# EAGLE schematic BenchPsu (EAGLE 6.6.0)
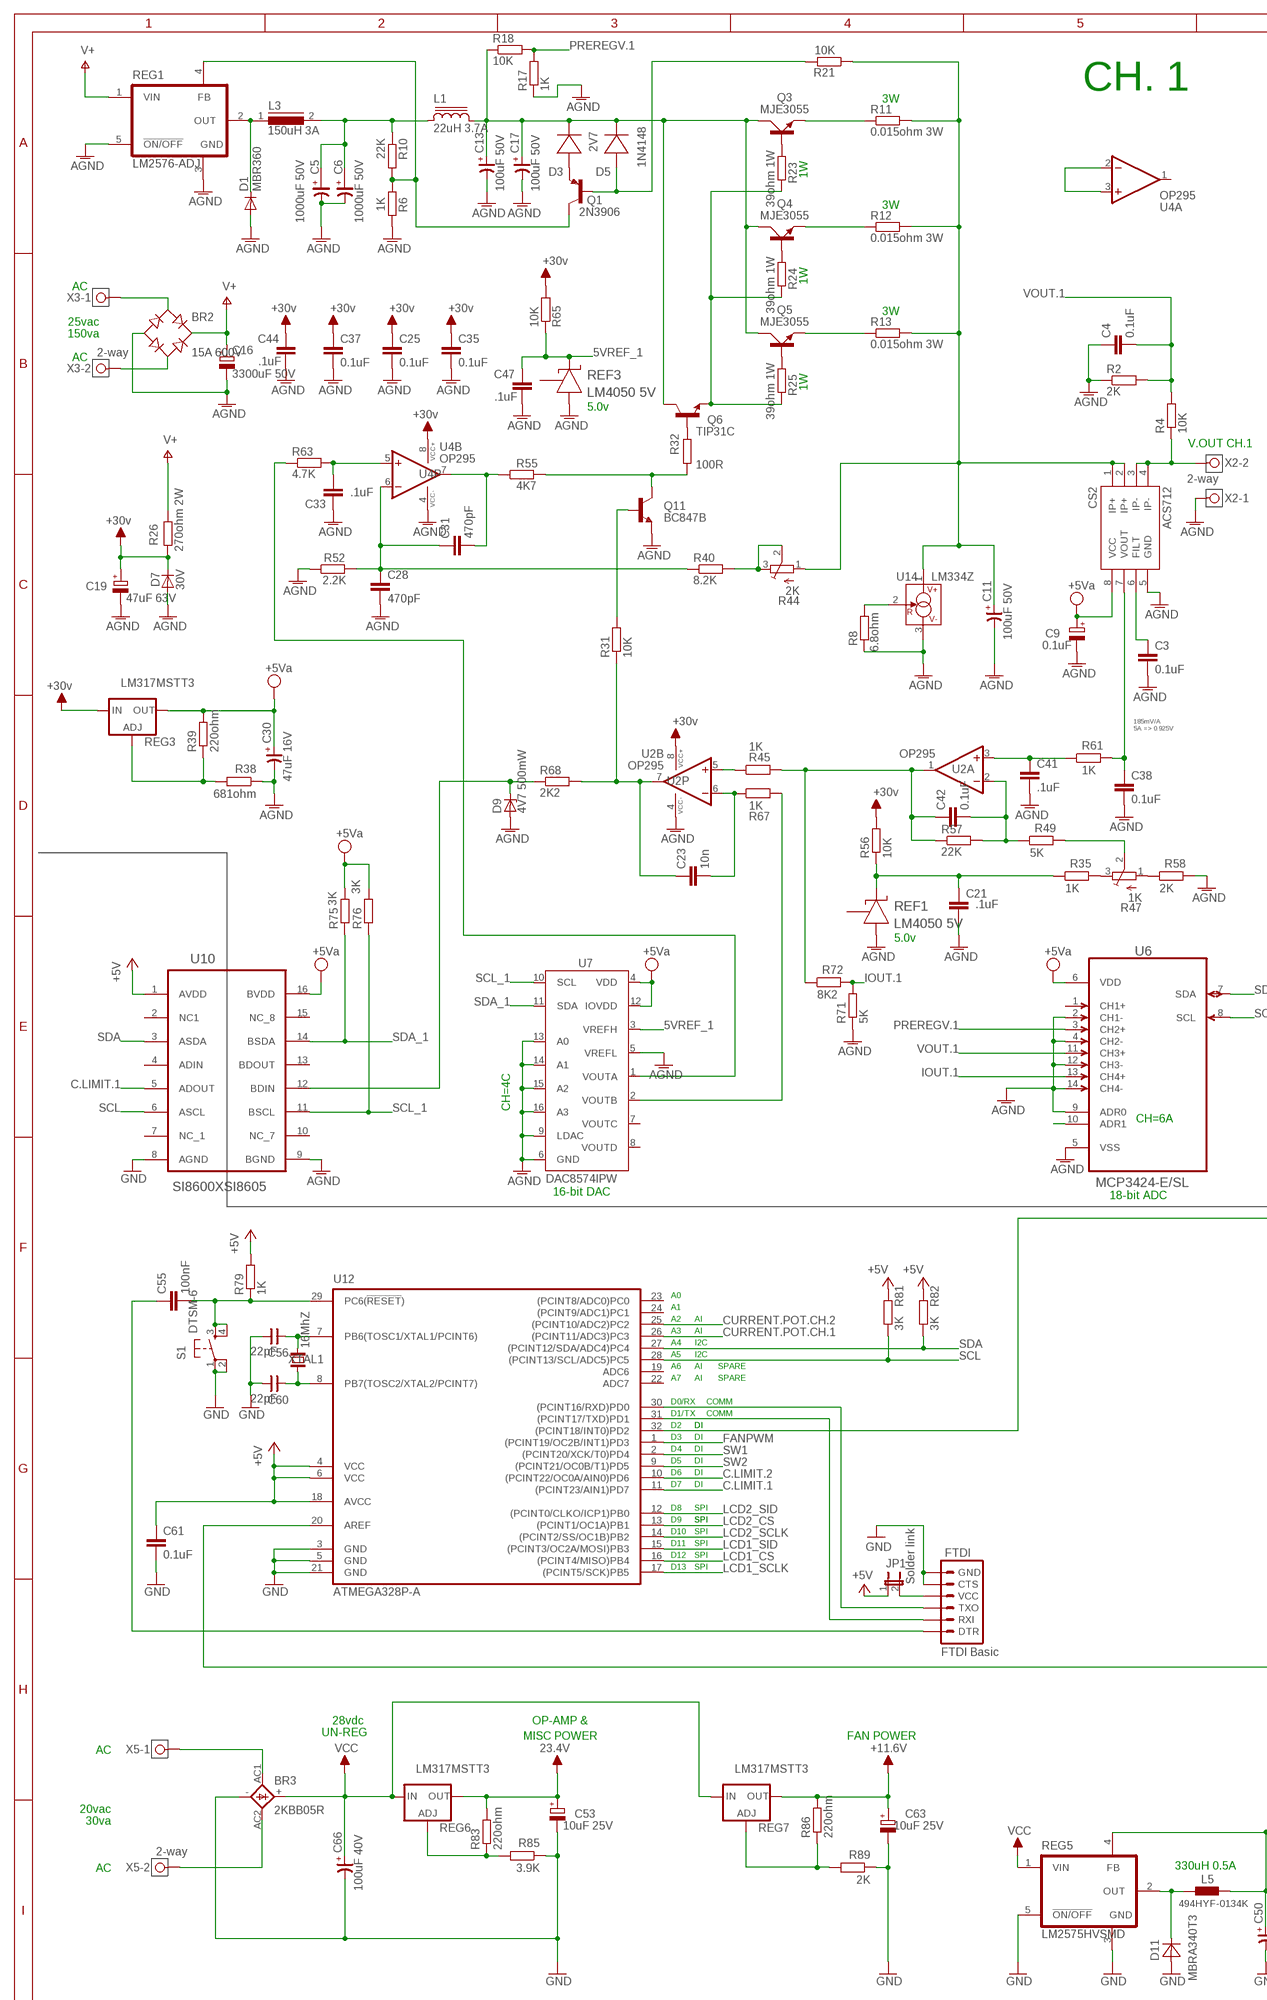
[diagram p0: schematic, sheet 1, part 1 of 2]
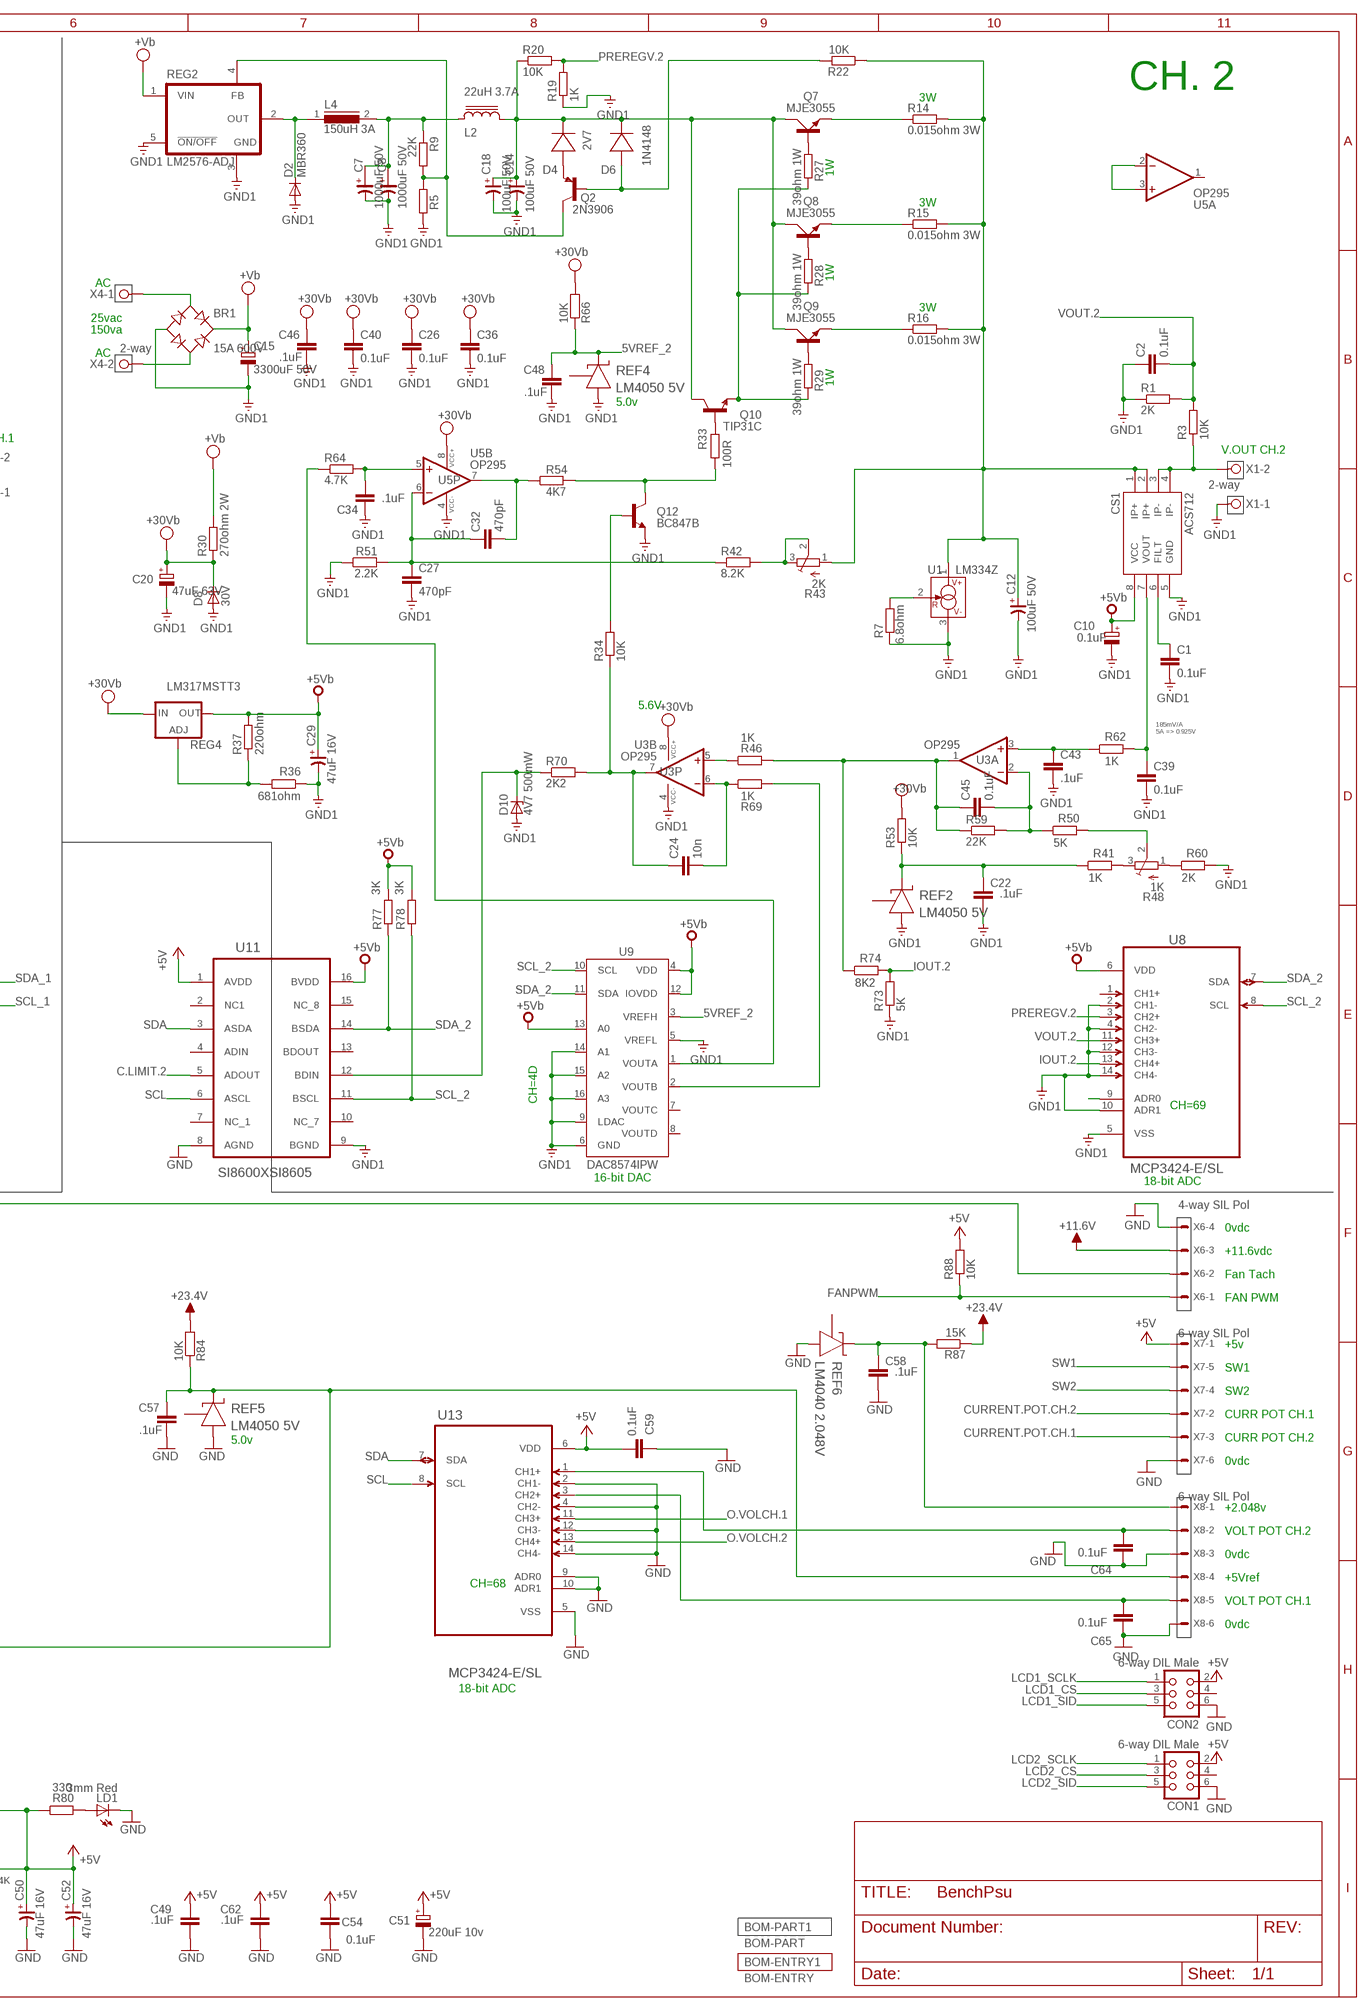
[diagram p1: schematic, sheet 1, part 2 of 2]
BOM-PART1 (BOM-PART): BOM: INCLUDE; QTY: 1

## Parts
BR1  15A 600V  GSIB_15A  [GSIB_15A]
BR2  15A 600V  GSIB_15A  [GSIB_15A]
BR3  2KBB05R  2KBB-R  [2KBB-R]
C1  0.1uF  C-EUC0805  [C0805]
C2  0.1uF  C-EUC0805  [C0805]
C3  0.1uF  C-EUC0805  [C0805]
C4  0.1uF  C-EUC0805  [C0805]
C5  1000uF 50V  C-PRE5,0-12  [E5,0-12]
C6  1000uF 50V  C-PRE5,0-12  [E5,0-12]
C7  1000uF 50V  C-PRE5,0-12  [E5,0-12]
C8  1000uF 50V  C-PRE5,0-12  [E5,0-12]
C9  0.1uF  CPOL-EUE2-5  [E2-5]
C10  0.1uF  CPOL-EUE2-5  [E2-5]
C11  100uF 50V  CP-E-050X125  [E-050X125]
C12  100uF 50V  CP-E-050X125  [E-050X125]
C13  100uF 50V  CP-E-035X080  [E-035X080]
C14  100uF 50V  CP-E-035X080  [E-035X080]
C15  3300uF 50V  CPOL-EUE7.5-18  [E7,5-18]
C16  3300uF 50V  CPOL-EUE7.5-18  [E7,5-18]
C17  100uF 50V  CP-E-035X080  [E-035X080]
C18  100uF 50V  CP-E-035X080  [E-035X080]
C19  47uF 63V  CPOL-EUE2.5-7  [E2,5-7]
C20  47uF 63V  CPOL-EUE2.5-7  [E2,5-7]
C21  .1uF  C-EUC0805  [C0805]
C22  .1uF  C-EUC0805  [C0805]
C23  10n  C-EUC0805  [C0805]
C24  10n  C-EUC0805  [C0805]
C25  0.1uF  C-EUC0805  [C0805]
C26  0.1uF  C-EUC0805  [C0805]
C27  470pF  C-EUC0805  [C0805]
C28  470pF  C-EUC0805  [C0805]
C29  47uF 16V  CP-SV-C  [SV-C]
C30  47uF 16V  CP-SV-C  [SV-C]
C31  470pF  C-EUC0805  [C0805]
C32  470pF  C-EUC0805  [C0805]
C33  .1uF  C-EUC0805  [C0805]
C34  .1uF  C-EUC0805  [C0805]
C35  0.1uF  C-EUC0805  [C0805]
C36  0.1uF  C-EUC0805  [C0805]
C37  0.1uF  C-EUC0805  [C0805]
C38  0.1uF  C-EUC0805  [C0805]
C39  0.1uF  C-EUC0805  [C0805]
C40  0.1uF  C-EUC0805  [C0805]
C41  .1uF  C-EUC0805  [C0805]
C42  0.1uF  C-EUC0805  [C0805]
C43  .1uF  C-EUC0805  [C0805]
C44  .1uF  C-EUC0805  [C0805]
C45  0.1uF  C-EUC0805  [C0805]
C46  .1uF  C-EUC0805  [C0805]
C47  .1uF  C-EUC0805  [C0805]
C48  .1uF  C-EUC0805  [C0805]
C49  .1uF  C-EUC0805  [C0805]
C50  47uF 16V  CP-SV-C  [SV-C]
C51  220uF 10v  CPOL-EUE2-5  [E2-5]
C52  47uF 16V  CP-SV-C  [SV-C]
C53  10uF 25V  CPOL-EUE2-5  [E2-5]
C54  0.1uF  C-EUC0805  [C0805]
C55  100nF  C-EUC0805  [C0805]
C56  22pF  CBP-ENP-015-040  [ENP-015-040]
C57  .1uF  C-EUC0805  [C0805]
C58  .1uF  C-EUC0805  [C0805]
C59  0.1uF  C-EUC0805  [C0805]
C60  22pF  CBP-ENP-015-040  [ENP-015-040]
C61  0.1uF  C-EUC0805  [C0805]
C62  .1uF  C-EUC0805  [C0805]
C63  10uF 25V  CPOL-EUE2-5  [E2-5]
C64  0.1uF  C-EUC0805  [C0805]
C65  0.1uF  C-EUC0805  [C0805]
C66  100uF 40V  CP-SV-E/F  [SV-E/F]
CON1  6-way DIL Male  CON06  [CON06]
CON2  6-way DIL Male  CON06  [CON06]
CS1  ACS712  [SO08]
CS2  ACS712  [SO08]
D1  MBR360  1N5400VERTICAL  [DO-201-15_V]
D2  MBR360  1N5400VERTICAL  [DO-201-15_V]
D3  2V7  DIODE  [SOD123]
D4  2V7  DIODE  [SOD123]
D5  1N4148  DIODE  [SOD123]
D6  1N4148  DIODE  [SOD123]
D7  30V  1N5060GPVERTICAL  [D015-12_V]
D8  30V  1N5060GPVERTICAL  [D015-12_V]
D9  4V7 500mW  ZENER-DIODESOD80C  [SOD80C]
D10  4V7 500mW  ZENER-DIODESOD80C  [SOD80C]
D11  MBRA340T3  [SMA]
FTDI  FTDI Basic  ARDUINO_SERIAL_PROGRAMPTH  [1X06]
JP1  Solder link  JP1E  [JP1]
L1  22uH 3.7A  L-  [RS749-8366_THT22UH]
L2  22uH 3.7A  L-  [RS749-8366_THT22UH]
L3  150uH 3A  SFT1030  [SFT1030]
L4  150uH 3A  SFT1030  [SFT1030]
L5  494HYF-0134K  [0.2PIN_0.3DIA]
LD1  3mm Red  LED3MM  [LED3MM]
Q1  2N3906  BC327SMD  [SOT23-BEC]
Q2  2N3906  BC327SMD  [SOT23-BEC]
Q3  MJE3055  [TO220AV]
Q4  MJE3055  [TO220AV]
Q5  MJE3055  [TO220AV]
Q6  TIP31C  TIP31CVERTICAL  [TO220V]
Q7  MJE3055  [TO220AV]
Q8  MJE3055  [TO220AV]
Q9  MJE3055  [TO220AV]
Q10  TIP31C  TIP31CVERTICAL  [TO220V]
Q11  BC847B  BC847BSMD  [SOT23]
Q12  BC847B  BC847BSMD  [SOT23]
R1  2K  R-EU_R0805  [R0805]
R2  2K  R-EU_R0805  [R0805]
R3  10K  R-EU_R0805  [R0805]
R4  10K  R-EU_R0805  [R0805]
R5  1K  R-EU_R0805  [R0805]
R6  1K  R-EU_R0805  [R0805]
R7  6.8ohm  R-EU_R0805  [R0805]
R8  6.8ohm  R-EU_R0805  [R0805]
R9  22K  R-EU_R0805  [R0805]
R10  22K  R-EU_R0805  [R0805]
R11  0.015ohm 3W  R-EU_R2512  [R2512]
R12  0.015ohm 3W  R-EU_R2512  [R2512]
R13  0.015ohm 3W  R-EU_R2512  [R2512]
R14  0.015ohm 3W  R-EU_R2512  [R2512]
R15  0.015ohm 3W  R-EU_R2512  [R2512]
R16  0.015ohm 3W  R-EU_R2512  [R2512]
R17  1K  R-EU_R0805  [R0805]
R18  10K  R-EU_R0805  [R0805]
R19  1K  R-EU_R0805  [R0805]
R20  10K  R-EU_R0805  [R0805]
R21  10K  R-EU_R0805  [R0805]
R22  10K  R-EU_R0805  [R0805]
R23  39ohm 1W  R-EU_0411/3V  [0411V]
R24  39ohm 1W  R-EU_0411/3V  [0411V]
R25  39ohm 1W  R-EU_0411/3V  [0411V]
R26  270ohm 2W  R-EU_0613/5V  [P0613V]
R27  39ohm 1W  R-EU_0411/3V  [0411V]
R28  39ohm 1W  R-EU_0411/3V  [0411V]
R29  39ohm 1W  R-EU_0411/3V  [0411V]
R30  270ohm 2W  R-EU_0613/5V  [P0613V]
R31  10K  R-EU_R0805  [R0805]
R32  100R  R-EU_R0805  [R0805]
R33  100R  R-EU_R0805  [R0805]
R34  10K  R-EU_R0805  [R0805]
R35  1K  R-EU_R0805  [R0805]
R36  681ohm  R-EU_R0805  [R0805]
R37  220ohm  R-EU_R0805  [R0805]
R38  681ohm  R-EU_R0805  [R0805]
R39  220ohm  R-EU_R0805  [R0805]
R40  8.2K  R-EU_R0805  [R0805]
R41  1K  R-EU_R0805  [R0805]
R42  8.2K  R-EU_R0805  [R0805]
R43  2K  TRIM_EU-SM-42/43W  [SM-42/43W]
R44  2K  TRIM_EU-SM-42/43W  [SM-42/43W]
R45  1K  R-EU_R0805  [R0805]
R46  1K  R-EU_R0805  [R0805]
R47  1K  TRIM_EU-3223W  [3223W]
R48  1K  TRIM_EU-SM-42/43W  [SM-42/43W]
R49  5K  R-EU_R0805  [R0805]
R50  5K  R-EU_R0805  [R0805]
R51  2.2K  R-EU_R0805  [R0805]
R52  2.2K  R-EU_R0805  [R0805]
R53  10K  R-EU_R0805  [R0805]
R54  4K7  R-EU_R0805  [R0805]
R55  4K7  R-EU_R0805  [R0805]
R56  10K  R-EU_R0805  [R0805]
R57  22K  R-EU_R0805  [R0805]
R58  2K  R-EU_R0805  [R0805]
R59  22K  R-EU_R0805  [R0805]
R60  2K  R-EU_R0805  [R0805]
R61  1K  R-EU_R0805  [R0805]
R62  1K  R-EU_R0805  [R0805]
R63  4.7K  R-EU_R0805  [R0805]
R64  4.7K  R-EU_R0805  [R0805]
R65  10K  R-EU_R0805  [R0805]
R66  10K  R-EU_R0805  [R0805]
R67  1K  R-EU_R0805  [R0805]
R68  2K2  R-EU_R0805  [R0805]
R69  1K  R-EU_R0805  [R0805]
R70  2K2  R-EU_R0805  [R0805]
R71  5K  R-EU_R0805  [R0805]
R72  8K2  R-EU_R0805  [R0805]
R73  5K  R-EU_R0805  [R0805]
R74  8K2  R-EU_R0805  [R0805]
R75  3K  R-EU_R0805  [R0805]
R76  3K  R-EU_R0805  [R0805]
R77  3K  R-EU_R0805  [R0805]
R78  3K  R-EU_R0805  [R0805]
R79  1K  R-EU_R0805  [R0805]
R80  330  R-EU_R0805  [R0805]
R81  3K  R-EU_R0805  [R0805]
R82  3K  R-EU_R0805  [R0805]
R83  220ohm  R-EU_R0805  [R0805]
R84  10K  R-EU_R0805  [R0805]
R85  3.9K  R-EU_R0805  [R0805]
R86  220ohm  R-EU_R0805  [R0805]
R87  15K  R-EU_R0805  [R0805]
R88  10K  R-EU_R0805  [R0805]
R89  2K  R-EU_R0805  [R0805]
REF1  LM4050 5V  LM4040A20IDBZT  [SOT95P237X112-3N]
REF2  LM4050 5V  LM4040A20IDBZT  [SOT95P237X112-3N]
REF3  LM4050 5V  LM4040A20IDBZT  [SOT95P237X112-3N]
REF4  LM4050 5V  LM4040A20IDBZT  [SOT95P237X112-3N]
REF5  LM4050 5V  LM4040A20IDBZT  [SOT95P237X112-3N]
REF6  LM4040 2.048V  LM4040A20IDBZT  [SOT95P237X112-3N]
REG1  LM2576-ADJ  LM2575HV_VVERTICAL_2  [LM2575HV_V_2]
REG2  LM2576-ADJ  LM2575HV_VVERTICAL_2  [LM2575HV_V_2]
REG3  LM317MSTT3  [SOT223]
REG4  LM317MSTT3  [SOT223]
REG5  LM2575HVSMD  [TO263-5]
REG6  LM317MSTT3  [SOT223]
REG7  LM317MSTT3  [SOT223]
S1  DTSM-6  [DTSM-6]
U1  LM334Z  [TO92]
U2  OP295  TL072N  [SO08]
U3  OP295  TL072N  [SO08]
U4  OP295  TL072N  [SO08]
U5  OP295  TL072N  [SO08]
U6  MCP3424-E/SL  [SOIC127P600X175-14N]
U7  DAC8574IPW  [TSSOP16]
U8  MCP3424-E/SL  [SOIC127P600X175-14N]
U9  DAC8574IPW  [TSSOP16]
U10  SI8600XSI8605  [SOIC16N]
U11  SI8600XSI8605  [SOIC16N]
U12  ATMEGA328P-A  ATMEGA48P/88P/168P/328P-A  [TQFP32A]
U13  MCP3424-E/SL  [SOIC127P600X175-14N]
U14  LM334Z  [TO92]
X1  2-way  W237-02P  [W237-132]
X2  2-way  W237-02P  [W237-132]
X3  2-way  W237-02P  [W237-132]
X4  2-way  W237-02P  [W237-132]
X5  2-way  W237-02P  [W237-132]
X6  4-way SIL Pol  22-23-2041  [22-23-2041]
X7  6-way SIL Pol  22-23-2061  [22-23-2061]
X8  6-way SIL Pol  22-23-2061  [22-23-2061]
XTAL1  16MhZ  CRYTALHC49S  [HC49/S@1]

## Nets
2.048V: C58.1 R87.2 REF6.1(CATHODE) X8.1
5VREF_1: C47.1 R65.1 REF3.1(CATHODE) U7.3(VREFH)
5VREF_2: C48.1 R66.1 REF4.1(CATHODE) U9.3(VREFH)
+5V: C49.1 C50.+ C51.+ C52.+ C54.2 C59.1 C61.1 C62.1 CON1.2 CON2.2 JP1.1 L5.2 R79.2 R80.1 R81.2 R82.2 R88.2 REG5.4(FB) U10.1(AVDD) U11.1(AVDD) U12.4(VCC) U12.6(VCC) U12.18(AVCC) U13.6(VDD) X7.1
+5VT: C10.+ C29.+ CS1.8(VCC) R37.2 R77.2 R78.2 REG4.4(OUT) U8.6(VDD) U9.4(VDD) U9.12(IOVDD) U9.13(A0) U11.16(BVDD) ; supply symbol labelled +5Vb
+12V: C63.+ R86.2 REG7.4(OUT) X6.3 ; supply symbol labelled +11.6V
+24V: C53.+ R83.2 R84.2 R87.1 REG6.4(OUT) ; supply symbol labelled 23.4V, +23.4V
AGND: BR2.- C3.2 C4.1 C5.- C6.- C9.- C11.- C13.- C16.- C17.- C19.- C21.2 C25.2 C28.2 C30.- C33.1 C35.2 C37.2 C38.2 C41.2 C44.2 C47.2 CS2.5(GND) D1.A D7.A D9.A Q11.2(E) R2.1 R6.2 R8.1 R17.1 R38.1 R52.1 R58.2 R71.1 REF1.2(A) REF3.2(A) REG1.3(GND) REG1.5(!ON/OFF) U2.4(P:VCC-) U4.4(P:VCC-) U6.2(CH1-) U6.4(CH2-) U6.5(VSS) U6.9(ADR0) U6.12(CH3-) U6.14(CH4-) U7.5(VREFL) U7.6(GND) U7.9(LDAC) U7.13(A0) U7.14(A1) U7.15(A2) U7.16(A3) U10.9(BGND) U14.3(V-) X2.1
AVCC: C19.+ C25.1 C35.1 C37.1 C44.1 D7.C R26.1 R56.2 R65.2 REG3.3(IN) U2.8(P:VCC+) U4.8(P:VCC+) ; supply symbol labelled +30v
C.LIMIT.1: U10.5(ADOUT) U12.11((PCINT23/AIN1)PD7)
C.LIMIT.2: U11.5(ADOUT) U12.10((PCINT22/OC0A/AIN0)PD6)
CURRENT.POT.CH.1: U12.26((PCINT11/ADC3)PC3) X7.3
CURRENT.POT.CH.2: U12.25((PCINT10/ADC2)PC2) X7.2
FANPWM: R88.1 U12.1((PCINT19/OC2B/INT1)PD3) X6.1
GND: BR3.- C49.2 C50.- C51.- C52.- C53.- C54.1 C56.1 C57.2 C58.2 C59.2 C60.1 C61.2 C62.2 C63.- C64.2 C65.2 C66.- CON1.6 CON2.6 D11.A FTDI.5(CTS) FTDI.6(GND) LD1.K(C) R85.1 R89.1 REF5.2(A) REF6.2(A) REG5.3(GND) REG5.5(!ON/OFF) S1.1 S1.2 U10.8(AGND) U11.8(AGND) U12.3(GND) U12.5(GND) U12.21(GND) U13.2(CH1-) U13.4(CH2-) U13.5(VSS) U13.9(ADR0) U13.10(ADR1) U13.12(CH3-) U13.14(CH4-) X6.4 X7.6 X8.3 X8.6
GND1: BR1.- C1.2 C2.1 C7.- C8.- C10.- C12.- C14.- C15.- C18.- C20.- C22.2 C26.2 C27.2 C29.- C34.1 C36.2 C39.2 C40.2 C43.2 C46.2 C48.2 CS1.5(GND) D2.A D8.A D10.A Q12.2(E) R1.1 R5.2 R7.1 R19.1 R36.1 R51.1 R60.2 R73.1 REF2.2(A) REF4.2(A) REG2.3(GND) REG2.5(!ON/OFF) U1.3(V-) U3.4(P:VCC-) U5.4(P:VCC-) U8.2(CH1-) U8.4(CH2-) U8.5(VSS) U8.10(ADR1) U8.12(CH3-) U8.14(CH4-) U9.5(VREFL) U9.6(GND) U9.9(LDAC) U9.14(A1) U9.15(A2) U9.16(A3) U11.9(BGND) X1.1
IOUT.1: R71.2 R72.2 U6.13(CH4+)
IOUT.2: R73.2 R74.2 U8.13(CH4+)
LCD1_CS: CON2.3 U12.16((PCINT4/MISO)PB4)
LCD1_SCLK: CON2.1 U12.17((PCINT5/SCK)PB5)
LCD1_SID: CON2.5 U12.15((PCINT3/OC2A/MOSI)PB3)
LCD2_CS: CON1.3 U12.13((PCINT1/OC1A)PB1)
LCD2_SCLK: CON1.1 U12.14((PCINT2/SS/OC1B)PB2)
LCD2_SID: CON1.5 U12.12((PCINT0/CLKO/ICP1)PB0)
N$1: R38.2 R39.1 REG3.1(ADJ)
N$2: BR3.AC1 X5.1
N$3: D11.C L5.1 REG5.2(OUT)
N$4: BR3.AC2 X5.2
N$5: R47.2(S) R49.2
N$6: C42.2 R49.1 R57.2 U2.2(A:-IN)
N$7: C5.+ C6.+ L1.1 L3.2 R10.1
N$8: C41.1 R61.1 U2.3(A:+IN)
N$10: Q1.C R6.1 R10.2 REG1.4(FB)
N$11: D3.A(+) Q1.E
N$12: D5.A(+) Q1.B R21.2
N$13: R83.1 R85.2 REG6.1(ADJ)
N$15: C31.2 R55.1 U4.7(B:OUT)
N$17: C28.1 C31.1 R40.1 R52.2 U4.6(B:-IN)
N$19: Q11.1(B) R31.2
N$20: C23.1 R31.1 R68.2 U2.7(B:OUT)
N$22: R40.2 R44.2(S) R44.3(E)
N$23: R64.1 U9.1(VOUTA)
N$24: BR2.AC1 X3.1
N$25: U12.32((PCINT18/INT0)PD2) X6.2
N$26: LD1.A R80.2
N$27: C57.1 R84.1 REF5.1(CATHODE) U12.20(AREF) X8.4
N$28: C38.1 CS2.7(VOUT) R61.2
N$29: Q3.B R23.1
N$31: C55.1 FTDI.1(DTR)
N$32: C33.2 R63.2 U4.5(B:+IN)
N$33: R35.2 R47.3(E)
N$34: Q4.B R24.1
N$35: R69.2 U9.2(VOUTB)
N$36: U4.2(A:-IN) U4.3(A:+IN)
N$38: D10.C R70.1 U11.12(BDIN)
N$39: R47.1(A) R58.1
N$41: FTDI.4(VCC) JP1.2
N$43: R63.1 U7.1(VOUTA)
N$44: Q11.3(C) R32.2 R55.2
N$45: C56.2 U12.7(PB6(TOSC1/XTAL1/PCINT6)) XTAL1.2
N$46: C60.2 U12.8(PB7(TOSC2/XTAL2/PCINT7)) XTAL1.1
N$47: U5.2(A:-IN) U5.3(A:+IN)
N$48: C55.2 R79.1 S1.3 S1.4 U12.29(PC6(!RESET!))
N$49: R36.2 R37.1 REG4.1(ADJ)
N$50: R41.2 R48.3(E)
N$51: R48.1(A) R60.1
N$52: R8.2 U14.2(R)
N$53: U6.10(ADR1)
N$56: C22.1 R41.1 R53.1 REF2.1(CATHODE)
N$61: U8.9(ADR0)
N$62: D9.C R68.1 U10.12(BDIN)
N$63: Q5.B R25.1
N$64: C3.1 CS2.6(FILT)
N$65: C65.1 U13.3(CH2+) X8.5
N$66: C45.2 R50.1 R59.2 U3.2(A:-IN)
N$67: C43.1 R62.1 U3.3(A:+IN)
N$69: R86.1 R89.2 REG7.1(ADJ)
N$70: FTDI.2(RXI) U12.31((PCINT17/TXD)PD1)
N$72: R45.1 U2.5(B:+IN)
N$73: FTDI.3(TXO) U12.30((PCINT16/RXD)PD0)
N$75: C23.2 R67.1 U2.6(B:-IN)
N$76: D2.C L4.1 REG2.2(OUT)
N$77: C27.1 C32.1 R42.1 R51.2 U5.6(B:-IN)
N$78: Q12.1(B) R34.2
N$79: C24.1 R34.1 R70.2 U3.7(B:OUT)
N$80: C39.1 CS1.7(VOUT) R62.2
N$81: R7.2 U1.2(R)
N$82: C7.+ C8.+ L2.1 L4.2 R9.1
N$83: C34.2 R64.2 U5.5(B:+IN)
N$84: CS1.3(IP-) CS1.4(IP-) R3.1 X1.2
N$85: C1.1 CS1.6(FILT)
N$86: C32.2 R54.1 U5.7(B:OUT)
N$88: D4.A(+) Q2.E
N$90: Q12.3(C) R33.2 R54.2
N$91: D6.A(+) Q2.B R22.2
N$94: R48.2(S) R50.2
N$95: C24.2 R69.1 U3.6(B:-IN)
N$96: R46.1 U3.5(B:+IN)
N$97: R42.2 R43.2(S) R43.3(E)
N$99: Q10.3(E) R27.2 R28.2 R29.2
N$109: C64.1 U13.1(CH1+) X8.2
N$118: BR1.AC2 X4.2
N$121: Q6.3(E) R23.2 R24.2 R25.2
N$124: Q8.E R15.1
N$130: C21.1 R35.1 R56.1 REF1.1(CATHODE)
N$132: BR1.AC1 X4.1
N$143: R67.2 U7.2(VOUTB)
N$150: CS2.3(IP-) CS2.4(IP-) R4.1 X2.2
N$153: Q9.B R29.1
N$167: C11.+ CS2.1(IP+) CS2.2(IP+) R11.2 R12.2 R13.2 R21.1 R44.1(A) U14.1(V+)
N$168: Q5.E R13.1
N$173: Q6.1(B) R32.1
N$174: Q9.E R16.1
N$175: Q7.B R27.1
N$176: Q8.B R28.1
N$178: Q10.1(B) R33.1
N$183: D1.C L3.1 REG1.2(OUT)
N$190: Q3.E R11.1
N$191: Q4.E R12.1
N$193: BR2.AC2 X3.2
N$215: Q7.E R14.1
N$226: C14.+ C18.+ D4.C(-) D6.C(-) L2.2 Q7.C Q8.C Q9.C Q10.2(C) R20.1
N$229: Q2.C R5.1 R9.2 REG2.4(FB)
N$232: C12.+ CS1.1(IP+) CS1.2(IP+) R14.2 R15.2 R16.2 R22.1 R43.1(A) U1.1(V+)
O.VOLCH.1: U13.11(CH3+)
O.VOLCH.2: U13.13(CH4+)
PREREGV.1: R17.2 R18.2 U6.3(CH2+)
PREREGV.2: R19.2 R20.2 U8.3(CH2+)
PREVOUT.1: C13.+ C17.+ D3.C(-) D5.C(-) L1.2 Q3.C Q4.C Q5.C Q6.2(C) R18.1
QQQ: C42.1 R45.2 R57.1 R72.1 U2.1(A:OUT)
QQQ1: C45.1 R46.2 R59.1 R74.1 U3.1(A:OUT)
SCL: R81.1 U10.6(ASCL) U11.6(ASCL) U12.28((PCINT13/SCL/ADC5)PC5) U13.8(SCL)
SCL_1: R76.1 U6.8(SCL) U7.10(SCL) U10.11(BSCL)
SCL_2: R78.1 U8.8(SCL) U9.10(SCL) U11.11(BSCL)
SDA: R82.1 U10.3(ASDA) U11.3(ASDA) U12.27((PCINT12/SDA/ADC4)PC4) U13.7(SDA)
SDA_1: R75.1 U6.7(SDA) U7.11(SDA) U10.14(BSDA)
SDA_2: R77.1 U8.7(SDA) U9.11(SDA) U11.14(BSDA)
SW1: U12.2((PCINT20/XCK/T0)PD4) X7.5
SW2: U12.9((PCINT21/OC0B/T1)PD5) X7.4
V+: BR2.+ C16.+ R26.2 REG1.1(VIN)
VCC: BR3.+ C66.+ REG5.1(VIN) REG6.3(IN) REG7.3(IN)
VDD: C20.+ C26.1 C36.1 C40.1 C46.1 D8.C R30.1 R53.2 R66.2 REG4.3(IN) U3.8(P:VCC+) U5.8(P:VCC+) ; supply symbol labelled +30Vb
VEE: BR1.+ C15.+ R30.2 REG2.1(VIN) ; supply symbol labelled +Vb
VOUT.1: C4.2 R2.2 R4.2 U6.11(CH3+)
VOUT.2: C2.2 R1.2 R3.2 U8.11(CH3+)
VPP: C9.+ C30.+ CS2.8(VCC) R39.2 R75.2 R76.2 REG3.4(OUT) U6.6(VDD) U7.4(VDD) U7.12(IOVDD) U10.16(BVDD) ; supply symbol labelled +5Va
Unconnected: CON1.4 CON2.4 REF1.3(NC) REF2.3(NC) REF3.3(NC) REF4.3(NC) REF5.3(NC) REF6.3(NC) U4.1(A:OUT) U5.1(A:OUT) U6.1(CH1+) U7.7(VOUTC) U7.8(VOUTD) U8.1(CH1+) U9.7(VOUTC) U9.8(VOUTD) U10.2(NC1) U10.4(ADIN) U10.7(NC_1) U10.10(NC_7) U10.13(BDOUT) U10.15(NC_8) U11.2(NC1) U11.4(ADIN) U11.7(NC_1) U11.10(NC_7) U11.13(BDOUT) U11.15(NC_8) U12.19(ADC6) U12.22(ADC7) U12.23((PCINT8/ADC0)PC0) U12.24((PCINT9/ADC1)PC1)

## Notes on the sheet
- CH. 1 | CH. 2
- 3W | 3W
- 1W | 1W
- 3W | 3W
- 1W | 1W
- AC | AC
- 3W | 3W
- 25vac | 25vac
- 150va | 150va
- AC | AC
- 1W | 1W
- 5.0v | 5.0v
- V.OUT CH.1
- V.OUT CH.2
- 5.6V
- 185mV/A
  5A => 0.925V
- 185mV/A
  5A => 0.925V
- 5.0v
- CH=4C
- CH=4D
- CH=6A | CH=69
- 16-bit DAC | 16-bit DAC
- 18-bit ADC | 18-bit ADC
- 0vdc
- +11.6vdc
- Fan Tach
- A0
- A1
- FAN PWM
- A2 | AI
- A3 | AI
- A4 | I2C
- A5 | I2C
- +5v
- A6 | AI | SPARE
- A7 | AI | SPARE
- SW1
- D0/RX | COMM
- SW2
- D1/TX | COMM
- D2 | DI | DI
- CURR POT CH.1
- D3 | DI
- D4 | DI
- 5.0v | CURR POT CH.2
- D5 | DI
- D6 | DI
- 0vdc
- D7 | DI
- D8 | SPI
- D9 | SPI | SPI
- +2.048v
- D10 | SPI
- D11 | SPI
- VOLT POT CH.2
- D12 | SPI
- D13 | SPI
- 0vdc
- +5Vref
- CH=68
- VOLT POT CH.1
- 0vdc
- 18-bit ADC
- 28vdc | OP-AMP &
- UN-REG
- MISC POWER | FAN POWER
- AC
- 20vac
- 30va
- AC | 330uH 0.5A

## Library data of the parts
BR1 BR2 = rectifier:GSIB_15A
BR3 = rectifier:2KBB-R: RECTIFIER grid 3 x 5 mm; PARTNO: RS 700-5330
C1-C4 C21-C28 C31-C49 C54 C55 C57-C59 C61 C62 C64 C65 = rcl:C-EU: CAPACITOR, European symbol
C5-C8 = cap-pan:C-PR: POLARIZED RADIAL ELECTROLYTIC naming: grid - lead spacing, diameter
C9 C10 C51 C53 C63 = rcl:CPOL-EU: POLARIZED CAPACITOR, European symbol
C11 C12 = cap-master:CP-: POLARIZED CAP; PARTNO: RS 365-4329
C13 C14 C17 C18 = cap-master:CP-: POLARIZED CAP; PARTNO: RS 737-4421
C15 C16 = rcl:CPOL-EU: POLARIZED CAPACITOR, European symbol; PARTNO: RS 684-2030
C19 = rcl:CPOL-EU: POLARIZED CAPACITOR, European symbol; PARTNO: IanJ Stock
C20 = rcl:CPOL-EU: POLARIZED CAPACITOR, European symbol; PARTNO: IanJ stock
C29 C50 C52 = cap-master:CP-: POLARIZED CAP; PARTNO: *
C30 C66 = cap-master:CP-: POLARIZED CAP
C56 C60 = cap-master:CBP-: BIPOLAR CAP; PARTNO: Through hole
CON1 CON2 = con-harting:CON06: CONNECTOR; OC_FARNELL: unknown; OC_NEWARK: unknown
CS1 CS2 = SparkFun:ACS712
D1 D2 = diode:1N5400: DIODE standard rectifier, 3 A, 50 V (Motorola)
D3-D6 = diode2:DIODE
D7 D8 = diode:1N5060GP: DIODE controlled avalanche rectifier
D9 D10 = diode:ZENER-DIODE: Z-Diode
D11 = diode:MBRA340T3: Surface Mount Schottky Power Rectifier Source: http://www.onsemi.com/pub_link/Collateral/MBRA340T3-D.PDF
FTDI = SparkFun:ARDUINO_SERIAL_PROGRAM
JP1 = jumper:JP1E: JUMPER
L1 L2 = inductor-wurth:L-: INDUCTOR WE-TI Series; PARTNO: RS 749-8366
L3 L4 = inductors:SFT1030: INDUCTOR; PARTNO: RS 742-7991
L5 = inductors:494HYF-0134K: 330uH 0.54A RS 724-7354 MPN=494HYF-0134K
LD1 = led:LED: LED OSRAM: - CHIPLED LG R971, LG N971, LY N971, LG Q971, LY Q971, LO R971, LY R971 LH N974, LH R974 LS Q976, LO Q976, LY Q976 LO Q996 - Hyper CHIPLED LW Q18S LB Q993, LB Q99A, LB R99A - SideLED LS A670, LO A670, LY A670, LG A670, LP A670 LB A673, LV A673, LT A673, LW A673 LH A674 LY A675 LS A676, LA A676, LO A676, LY A676, LW A676 LS A679, LY A679, LG A679 - Hyper Micro SIDELED® LS Y876, LA Y876, LO Y876, LY Y876 LT Y87S - SmartLED LW L88C, LW L88S LB L89C, LB L89S, LG L890 LS L89K, LO L89K, LY L89K LS L896, LA L896, LO L896, LY L896 - TOPLED LS T670, LO T670, LY T670, LG T670, LP T670 LSG T670, LSP T670, LSY T670, LOP T670, LYG T670 LG T671, LOG T671, LSG T671 LB T673, LV T673, LT T673, LW T673 LH T674 LS T676, LA T676, LO T676, LY T676, LB T676, LH T676, LSB T676, LW T676 LB T67C, LV T67C, LT T67C, LS T67K, LO T67K, LY T67K, LW E67C LS E67B, LA E67B, LO E67B, LY E67B, LB E67C, LV E67C, LT E67C LW T67C LS T679, LY T679, LG T679 LS T770, LO T770, LY T770, LG T770, LP T770 LB T773, LV T773, LT T773, LW T773 LH T774 LS E675, LA E675, LY E675, LS T675 LS T776, LA T776, LO T776, LY T776, LB T776 LHGB T686 LT T68C, LB T68C - Hyper Mini TOPLED® LB M676 - Mini TOPLED Santana® LG M470 LS M47K, LO M47K, LY M47K Source: http://www.osram.convergy.de LUXEON: - LUMILED® LXK2-PW12-R00, LXK2-PW12-S00, LXK2-PW14-U00, LXK2-PW14-V00 LXK2-PM12-R00, LXK2-PM12-S00, LXK2-PM14-U00 LXK2-PE12-Q00, LXK2-PE12-R00, LXK2-PE12-S00, LXK2-PE14-T00, LXK2-PE14-U00 LXK2-PB12-K00, LXK2-PB12-L00, LXK2-PB12-M00, LXK2-PB14-N00, LXK2-PB14-P00, LXK2-PB14-Q00 LXK2-PR12-L00, LXK2-PR12-M00, LXK2-PR14-Q00, LXK2-PR14-R00 LXK2-PD12-Q00, LXK2-PD12-R00, LXK2-PD12-S00 LXK2-PH12-R00, LXK2-PH12-S00 LXK2-PL12-P00, LXK2-PL12-Q00, LXK2-PL12-R00 Source: www.luxeon.com KINGBRIGHT: KA-3528ASYC Source: www.kingbright.com
Q1 Q2 = transistor-pnp:BC327*: PNP Transistror
Q3-Q5 Q7-Q9 = transistor-power:MJE3055: NPN TRANSISTOR
Q6 Q10 = transistor-npn:TIP31C*: NPN Transistor
Q11 Q12 = transistor-npn:BC847*: NPN Transistor
R1-R10 R17-R42 R45 R46 R49-R89 = rcl:R-EU_: RESISTOR, European symbol
R11-R16 = rcl:R-EU_: RESISTOR, European symbol; PARTNO: RS 720-3164
R43 R44 R47 R48 = pot:TRIM_EU-: POTENTIOMETER
REF1-REF6 = LM4040:LM4040A20IDBZT: PRECISION MICROPOWER SHUNT VOLTAGE REFERENCE; MPN: LM4040A20IDBZT; OC_FARNELL: 1702826; OC_NEWARK: 53K9321; PACKAGE: 3-SOT-23; SUPPLIER: TEXAS INSTRUMENTS
REG1 REG2 = LM2575HV:LM2575HV_V
REG3 REG4 REG6 REG7 = v-reg:LM317?*: 500 mA Adjustable Output Positive Voltage Regulator Source: http://www.onsemi.co.jp .. LM317M-D.PDF
REG5 = LM2575HV:LM2575HV: LM2575HV
S1 = switch-tact:DTSM-6
U1 U14 = linear:LM*34: 3-Terminal Adjustable Current Sources Source: www.national.com/pf/LM/LM334.html | LM134.pdf
U2-U5 = op-amp:TL072: JFET OP-AMP - Dual
U6 U8 U13 = MCP3424:MCP3424-E/SL: Analog-to-Digital Converter; MPN: MCP3424-E/SL; OC_FARNELL: 1630424; OC_NEWARK: 54M4871; PACKAGE: SOIC-14; SUPPLIER: Microchip
U7 U9 = DAC8574IPW:DAC8574IPW
U10 U11 = Si860x:SI8600X: Hot-Swappable, Dual I2C Isolators, 5 kV
U12 = atmel-avr:ATMEGA48P/88P/168P/328P: MICROCONTROLLER 4/8/16/32K Flash
X1-X5 = con-wago-508:W237-02P: WAGO SREW CLAMP; OC_FARNELL: unknown; OC_NEWARK: unknown
X6 = con-molex:22-23-2041: .100" (2.54mm) Center Header - 4 Pin; MF: MOLEX; MPN: 22-23-2041; OC_FARNELL: 1462920; OC_NEWARK: 38C0355
X7 X8 = con-molex:22-23-2061: .100" (2.54mm) Center Header - 6 Pin; MF: MOLEX; MPN: 22-23-2061; OC_FARNELL: 1462922; OC_NEWARK: 27C1933
XTAL1 = crystal:CRYTAL: CRYSTAL

## Net classes
1 vcc: width 0.254 mm
2 gnd: width 0.254 mm, drill 0.61 mm, clearance 0.254 mm
3 usbvcc: width 0.254 mm, drill 0.61 mm, clearance 0.254 mm
4 aref: width 0.254 mm, drill 0.61 mm, clearance 0.254 mm